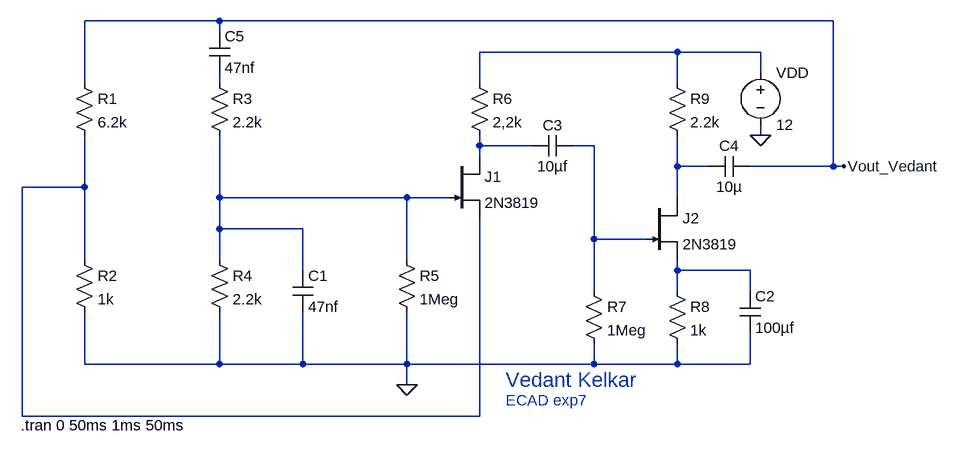
[diagram p0: schematic Draft46.asc]
Draft46.asc, the LTspice schematic file:
Version 4
SHEET 1 1240 680
WIRE 112 -32 -96 -32
WIRE 1056 -32 112 -32
WIRE 112 -16 112 -32
WIRE 816 16 512 16
WIRE 944 16 816 16
WIRE 944 48 944 16
WIRE -96 64 -96 -32
WIRE 112 64 112 48
WIRE 512 64 512 16
WIRE 816 64 816 16
WIRE 944 144 944 128
WIRE 512 160 512 144
WIRE 592 160 512 160
WIRE 688 160 656 160
WIRE 512 176 512 160
WIRE 816 192 816 144
WIRE 864 192 816 192
WIRE 1056 192 1056 -32
WIRE 1056 192 928 192
WIRE 1072 192 1056 192
WIRE -96 224 -96 144
WIRE -96 224 -192 224
WIRE 112 240 112 144
WIRE 400 240 112 240
WIRE 464 240 400 240
WIRE 816 240 816 192
WIRE 112 288 112 240
WIRE 240 288 112 288
WIRE 688 304 688 160
WIRE 768 304 688 304
WIRE -96 336 -96 224
WIRE 112 336 112 288
WIRE 400 336 400 240
WIRE 240 352 240 288
WIRE 816 352 816 336
WIRE 928 352 816 352
WIRE 688 384 688 304
WIRE 816 384 816 352
WIRE 928 384 928 352
WIRE -96 496 -96 416
WIRE 112 496 112 416
WIRE 112 496 -96 496
WIRE 240 496 240 416
WIRE 240 496 112 496
WIRE 400 496 400 416
WIRE 400 496 240 496
WIRE 688 496 688 464
WIRE 688 496 400 496
WIRE 816 496 816 464
WIRE 816 496 688 496
WIRE 928 496 928 448
WIRE 928 496 816 496
WIRE 400 528 400 496
WIRE -192 576 -192 224
WIRE 512 576 512 272
WIRE 512 576 -192 576
FLAG 1072 192 Vout_Vedant
FLAG 400 528 0
FLAG 944 144 0
SYMBOL res -112 48 R0
SYMATTR InstName R1
SYMATTR Value 6.2k
SYMBOL res -112 320 R0
SYMATTR InstName R2
SYMATTR Value 1k
SYMBOL res 96 48 R0
SYMATTR InstName R3
SYMATTR Value 2.2k
SYMBOL res 96 320 R0
SYMATTR InstName R4
SYMATTR Value 2.2k
SYMBOL res 384 320 R0
SYMATTR InstName R5
SYMATTR Value 1Meg
SYMBOL res 496 48 R0
SYMATTR InstName R6
SYMATTR Value 2,2k
SYMBOL njf 464 176 R0
SYMATTR InstName J1
SYMATTR Value 2N3819
SYMBOL cap 224 352 R0
SYMATTR InstName C1
SYMATTR Value 47nf
SYMBOL res 672 368 R0
SYMATTR InstName R7
SYMATTR Value 1Meg
SYMBOL res 800 368 R0
SYMATTR InstName R8
SYMATTR Value 1k
SYMBOL cap 912 384 R0
SYMATTR InstName C2
SYMATTR Value 100µf
SYMBOL njf 768 240 R0
SYMATTR InstName J2
SYMATTR Value 2N3819
SYMBOL cap 592 176 R270
WINDOW 0 32 32 VTop 2
WINDOW 3 0 32 VBottom 2
SYMATTR InstName C3
SYMATTR Value 10µf
SYMBOL res 800 48 R0
SYMATTR InstName R9
SYMATTR Value 2.2k
SYMBOL voltage 944 32 R0
WINDOW 123 0 0 Left 0
WINDOW 39 0 0 Left 0
SYMATTR InstName VDD
SYMATTR Value 12
SYMBOL cap 928 176 R90
WINDOW 0 0 32 VBottom 2
WINDOW 3 32 32 VTop 2
SYMATTR InstName C4
SYMATTR Value 10µ
SYMBOL cap 96 -16 R0
SYMATTR InstName C5
SYMATTR Value 47nf
TEXT -194 590 Left 2 !.tran 0 50ms 1ms 50ms
TEXT 552 520 Left 3 ;Vedant Kelkar
TEXT 552 552 Left 2 ;ECAD exp7

The netlist it stands for:
* Draft46.asc
R1 Vout_Vedant N006 6.2k
R2 N006 0 1k
R3 N002 N007 2.2k
R4 N007 0 2.2k
R5 N007 0 1Meg
R6 N001 N003 2,2k
J1 N003 N007 N006 2N3819
C1 N007 0 47nf
R7 N004 0 1Meg
R8 N008 0 1k
C2 N008 0 100µf
J2 N005 N004 N008 2N3819
C3 N003 N004 10µf
R9 N001 N005 2.2k
VDD N001 0 12
C4 Vout_Vedant N005 10µ
C5 Vout_Vedant N002 47nf
.model NJF NJF
.model PJF PJF
.lib standard.jft
.tran 0 50ms 1ms 50ms
* Vedant Kelkar
* ECAD exp7
.backanno
.end